# EAGLE design LipSync_Pressure_Board (EAGLE 9.5.2)
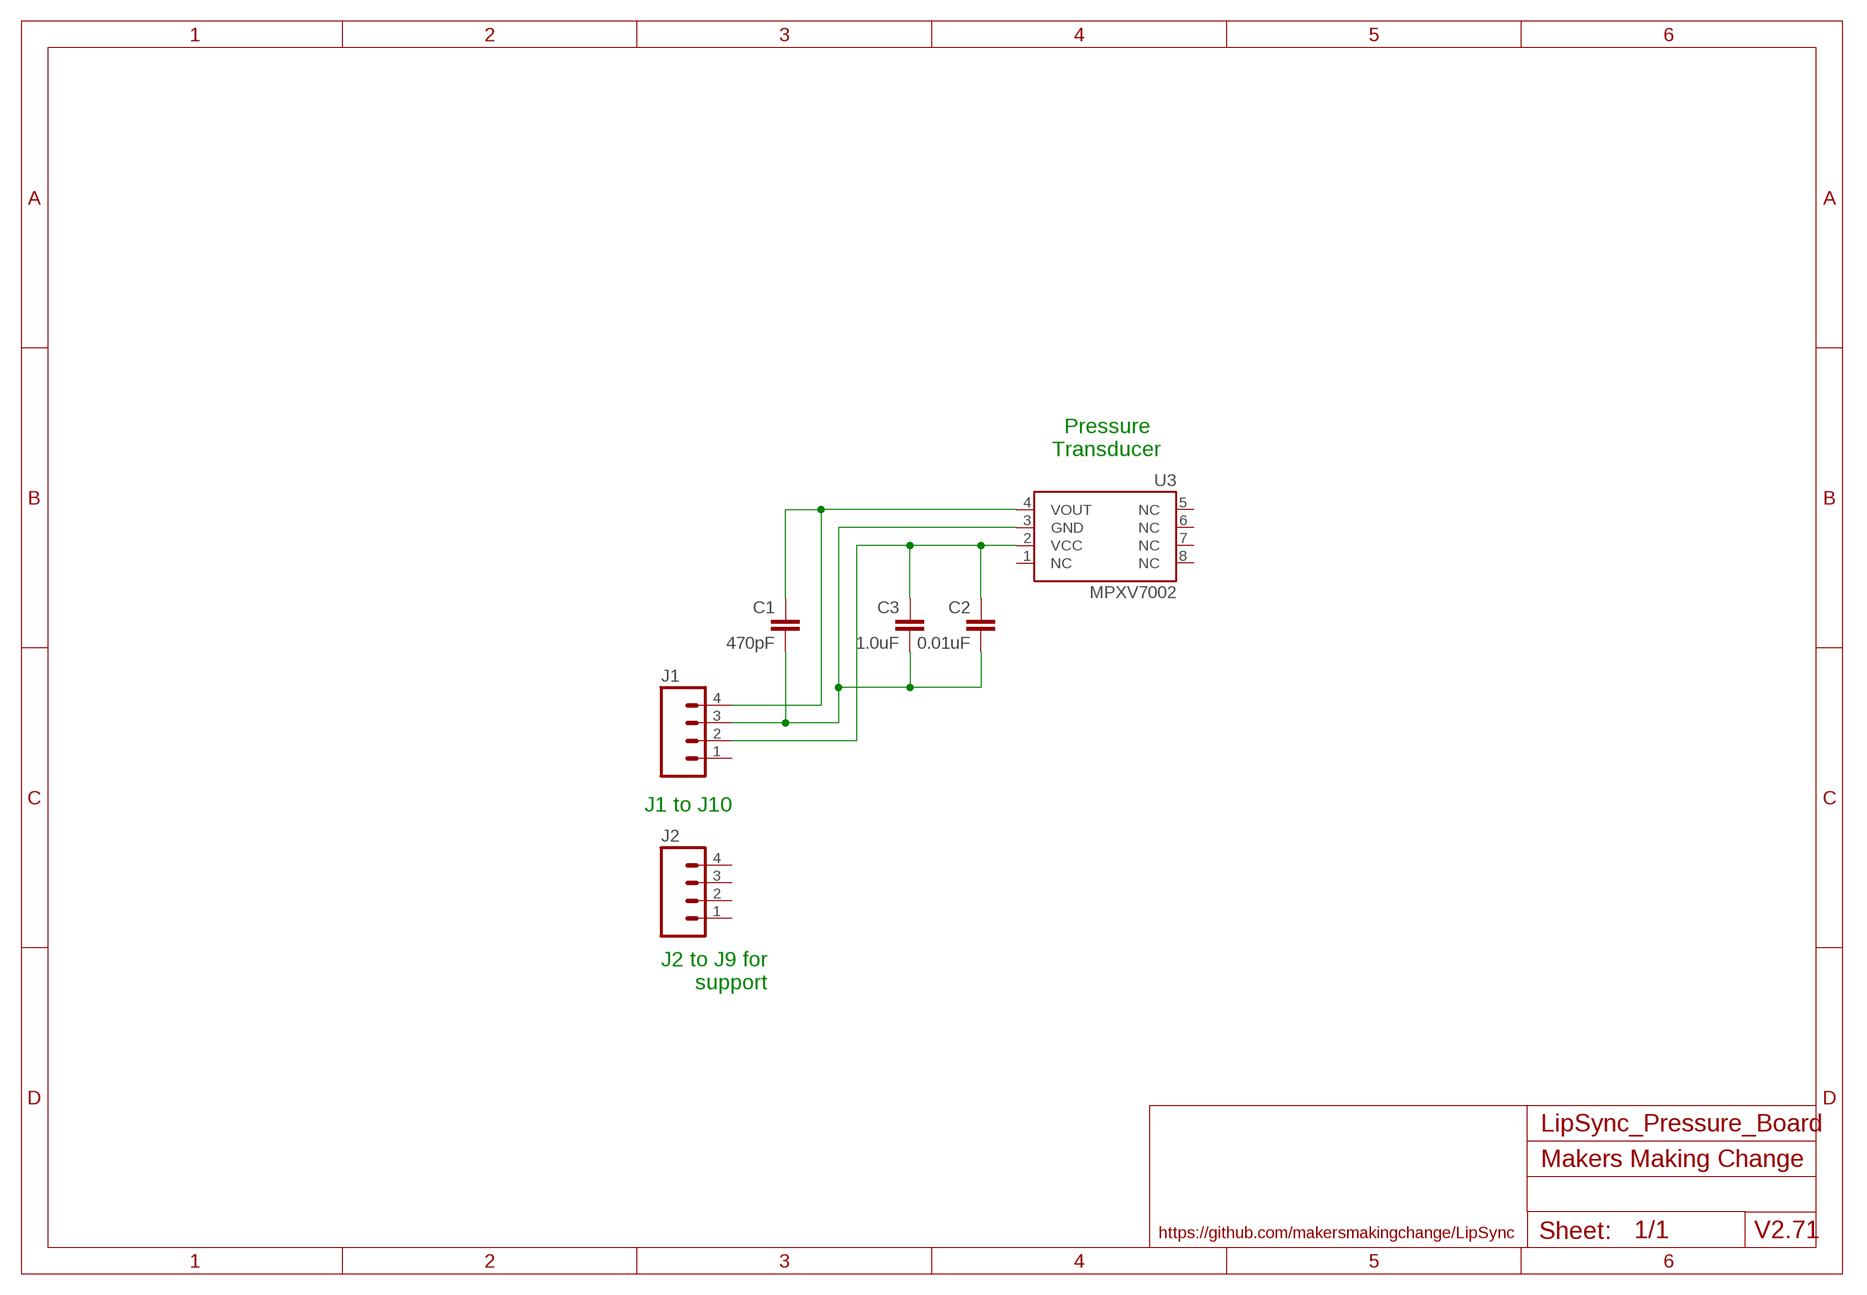
[diagram p0: schematic, sheet 1]

## Parts
C1  470pF  CAPEZ  [CAP-PTH-SMALLEZ]
C2  0.01uF  CAPEZ  [CAP-PTH-SMALLEZ]
C3  1.0uF  CAPEZ  [CAP-PTH-SMALLEZ]
J1  M04PTH  [1X04]
J2  M04PTH  [1X04]
U3  MPXV7002  [SOP8]

## Nets
GND2 [GND2]: C1.2 C2.2 C3.2 J1.3 U3.3(GND)
N$7: C1.1 J1.4 U3.4(VOUT)
N$8: C2.1 C3.1 J1.2 U3.2(VCC)
Unconnected: J1.1 J2.1 J2.2 J2.3 J2.4 U3.1(NC) U3.5(NC) U3.6(NC) U3.7(NC) U3.8(NC)

## Notes on the sheet
- Pressure
  Transducer
- J1 to J10
- J2 to J9 for
    support
- Makers Making Change
- https://github.com/makersmakingchange/LipSync | V2.71

## Library data of the parts
C1-C3 = SparkFun-Capacitors:CAP: Capacitor Standard 0603 ceramic capacitor, and 0.1" leaded capacitor.
J1 J2 = SparkFun-Connectors:M04: Header 4 Standard 4-pin 0.1" header. Use with straight break away headers (SKU : PRT-00116), right angle break away headers (PRT-00553), swiss pins (PRT-00743), machine pins (PRT-00117), and female headers (PRT-00115). Molex polarized connector foot print use with SKU : PRT-08231 with associated crimp pins and housings. 1MM SMD Version SKU: PRT-10208; PROD_ID: CONN-09696
U3 = IVAN_custom:MPXV7002: The MPXC7002 dual port differential sensor has an operating pressure of +/- 0.29psi with a maximum pressure of 10psi. The sensor occupies a SOP8 footprint with a 0.1" lead pitch.

## Net classes
0 GND: clearance 0.205 mm
2 GND2: clearance 0.205 mm to class 0, clearance 0.205 mm to class 1, clearance 0.205 mm
3 GND3: clearance 0.205 mm to class 0, clearance 0.205 mm to class 1, clearance 0.205 mm to class 2, clearance 0.205 mm

## Board
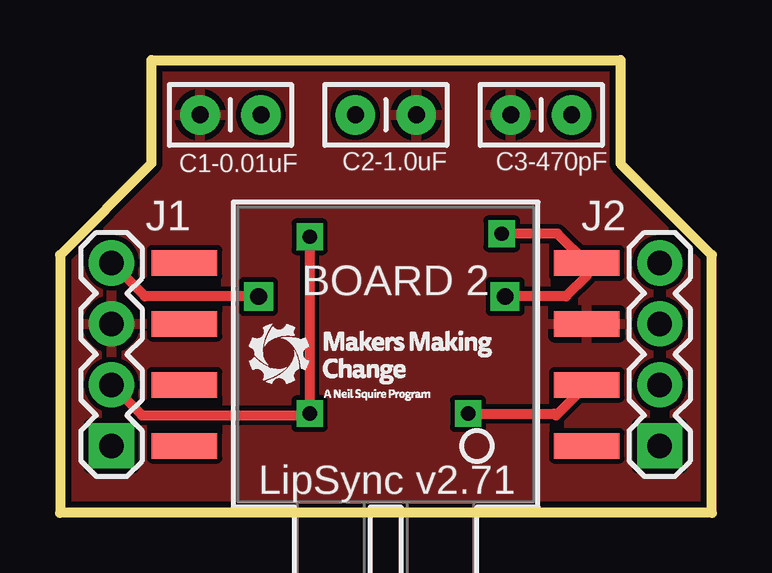
[diagram p1: board, top side]
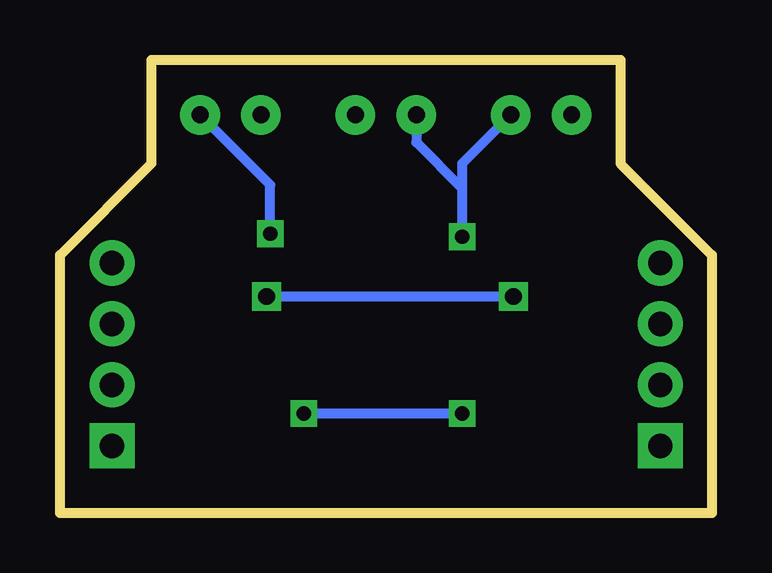
[diagram p2: board, bottom side, seen from below]

Size 27.18 x 18.87 mm. Coordinates in mm from the lower left corner, seen from the top.
Outline: 27.18,0 0,0 0,10.75 3.81,14.56 3.81,18.87 23.37,18.87 23.37,14.56 27.18,10.75 27.18,0
Copper layers (1*16): Top 0.035mm / dielectric 1.5mm / Bottom 0.035mm
Design rules "SparkFun": minimum track width 8mil, minimum drill 20mil, track to track 8mil, track to pad 8mil, pad to pad 8mil, via to via 8mil, smd to smd 8mil, copper to edge 10mil, drill to drill 8mil, minimum pad ring 12mil, minimum via ring 10mil, stop-mask expansion 4mil, vias tented up to drill 25mil, thermal gap 10mil

### Footprints (pad centres in the part's own frame; a part is rotated, then mirrored left to right if it is on the bottom)
CAP-PTH-SMALLEZ = drill 0.7 pad 1.651: 1 0,0; 2 2.54,0
1X04 = drill 1.016 pad 1.88 square: 1 0,0 | drill 1.016 pad 1.88: 2 2.54,0; 3 5.08,0; 4 7.62,0
SOP8 = smd 2.731 x 1.067: 1 8.382,-3.81; 2 8.382,-1.27; 3 8.382,1.27; 4 8.382,3.81; 5 -8.382,3.81; 6 -8.382,1.27; 7 -8.382,-1.27; 8 -8.382,-3.81

### Placement (x,y rotation side)
C1  21.34,16.59 180 top
C2  12.32,16.59 0 top
C3  8.38,16.59 180 top
J1  2.15,2.8 90 top
J2  25.01,2.8 90 top
U3  13.58,6.61 0 top

### Tracks (layer width: path | path; a pad name or v marks a point on that pad's centre or on a via)
GND2
  pour Top: 0,0 0,10.75 3.81,14.56 3.81,18.87 23.37,18.87 23.37,14.56 27.18,10.75 27.18,0
N$7  (via drill 0.6, 0.7 pad 1.02)
  Top 0.406: v18.56,9.02 21.1,9.02 21.96,9.88 U3.4 20.74,11.63 v18.41,11.63 | v8.28,9.02 3.54,9.02 J1.4
  Bottom 0.406: v18.56,9.02 v8.28,9.02 | v18.41,11.63 18.41,13.67 C1.1
N$8  (via drill 0.6)
  Top 0.406: J1.2 3.42,4.07 10.34,4.07 v10.41,4.14 v10.41,11.51 | U3.2 20.69,4.07 20.61,4.14 v17.02,4.14
  Bottom 0.406: v10.41,4.14 v17.02,4.14 | C3.1 10.41,14.56 10.41,13.54 | 10.41,13.54 v10.41,11.51 | C2.1 12.32,15.45 10.41,13.54

### Text on the board
tNames: C1-0.01uF | C2-1.0uF | C3-470pF | J1 | J2 | BOARD 2 | LipSync v2.71